# EAGLE schematic yep (EAGLE 7.6.0)
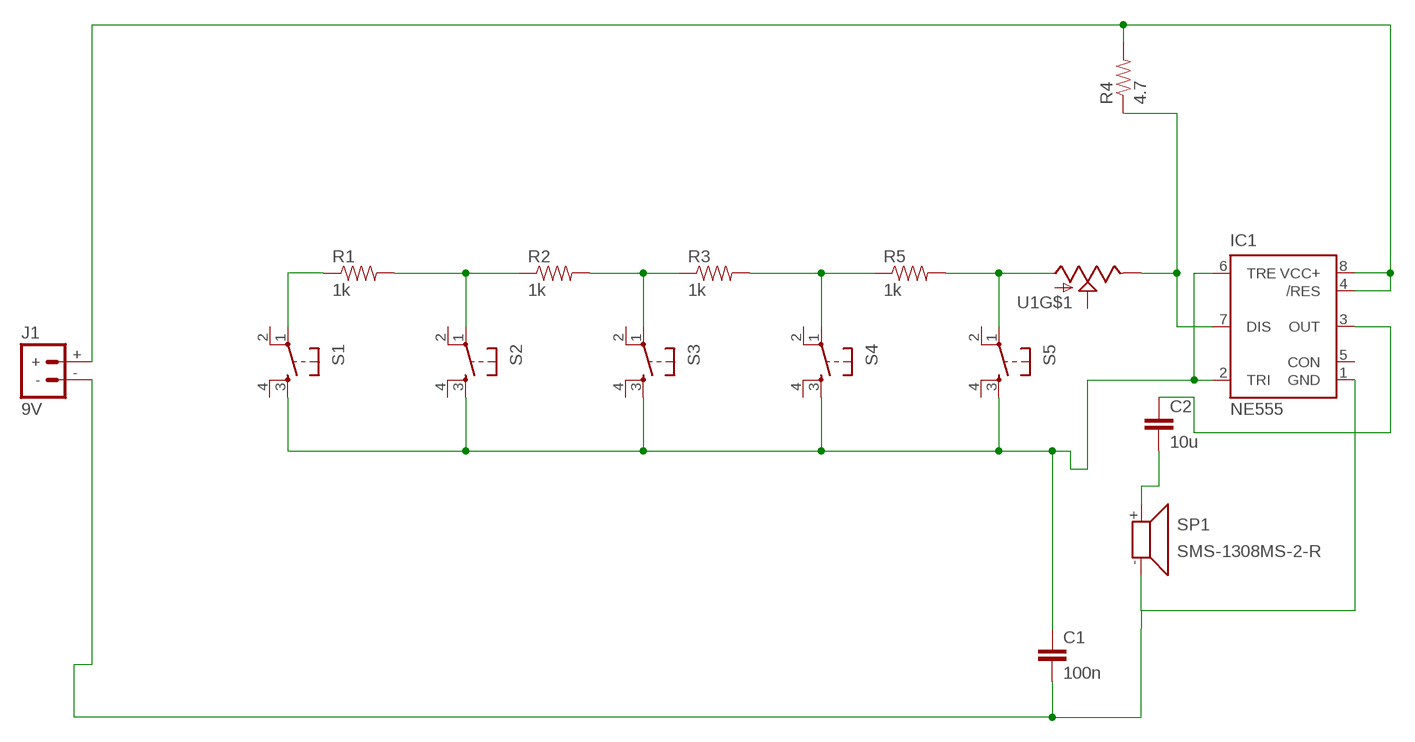
[diagram p0: schematic, sheet 1]

## Parts
C1  100n  CAP0603-CAP  [0603-CAP]
C2  10u  CAP0603-CAP  [0603-CAP]
IC1  NE555  [DIL-08]
J1  9V  BATTERY_CONNDEANS  [DEANS]
R1  1k  RESISTOR0603-RES  [0603-RES]
R2  1k  RESISTOR0603-RES  [0603-RES]
R3  1k  RESISTOR0603-RES  [0603-RES]
R4  4.7  RESISTOR0603-RES  [0603-RES]
R5  1k  RESISTOR0603-RES  [0603-RES]
S1  TAC_SWITCHPTH  [TACTILE-PTH]
S2  TAC_SWITCHPTH  [TACTILE-PTH]
S3  TAC_SWITCHPTH  [TACTILE-PTH]
S4  TAC_SWITCHPTH  [TACTILE-PTH]
S5  TAC_SWITCHPTH  [TACTILE-PTH]
SP1  SMS-1308MS-2-R  [SMS-1308MS-2-R]
U1  POT_SWITCHPOT_PTH  [POT_PTH]

## Nets
N$1: IC1.4(/RES) IC1.8(VCC+) J1.+ R4.2
N$2: IC1.7(DIS) R4.1 U1.E@2(E)
N$3: R1.2 R2.1 S2.1
N$4: R2.2 R3.1 S3.1
N$5: R3.2 R5.1 S4.1
N$6: R5.2 S5.1
N$7: R1.1 S1.1
N$8: C1.1 IC1.2(TRI) IC1.6(TRE) S1.3 S2.3 S3.3 S4.3 S5.3
N$9: C2.1 IC1.3(OUT)
N$10: C2.2 SP1.+
N$11: C1.2 IC1.1(GND) J1.- SP1.-
Unconnected: IC1.5(CON) S1.2 S1.4 S2.2 S2.4 S3.2 S3.4 S4.2 S4.4 S5.2 S5.4 U1.E@1(A) U1.S1 U1.S2 U1.WAND(S)

## Library data of the parts
C1 C2 = SparkFun-Capacitors:CAP: Capacitor Standard 0603 ceramic capacitor, and 0.1" leaded capacitor.
IC1 = st-microelectronics:NE555: General purpose bipolar Timer; MF: Arrow Electronics; MPN: NE555N; OC_FARNELL: 1467742; OC_NEWARK: 89K1486
J1 = SparkFun-Connectors:BATTERY_CONN: Various footprints for battery connectors
R1-R5 = SparkFun-Resistors:RESISTOR: Resistor Basic schematic elements and footprints for 0603, 1206, and PTH resistors.
S1-S5 = SparkFun-Retired:TAC_SWITCH: Momentary Switch Button commonly used for reset or general input. Spark Fun Electronics SKU : COM-00097 SMT- SWCH-08247
SP1 = speaker:SMS-1308MS-2-R: Speaker 13 x 13mm, 8 Ohm, 0.7W Source: pui audio inc. SMS-1308MS-2-R.pdf
U1 = SparkFun-Electromechanical:POT_SWITCH: Potentiometer w/ switch.